# Altium schematic sheet Shift Registers.SchDoc
size A4; SheetNumber: 4; SheetTotal: 4
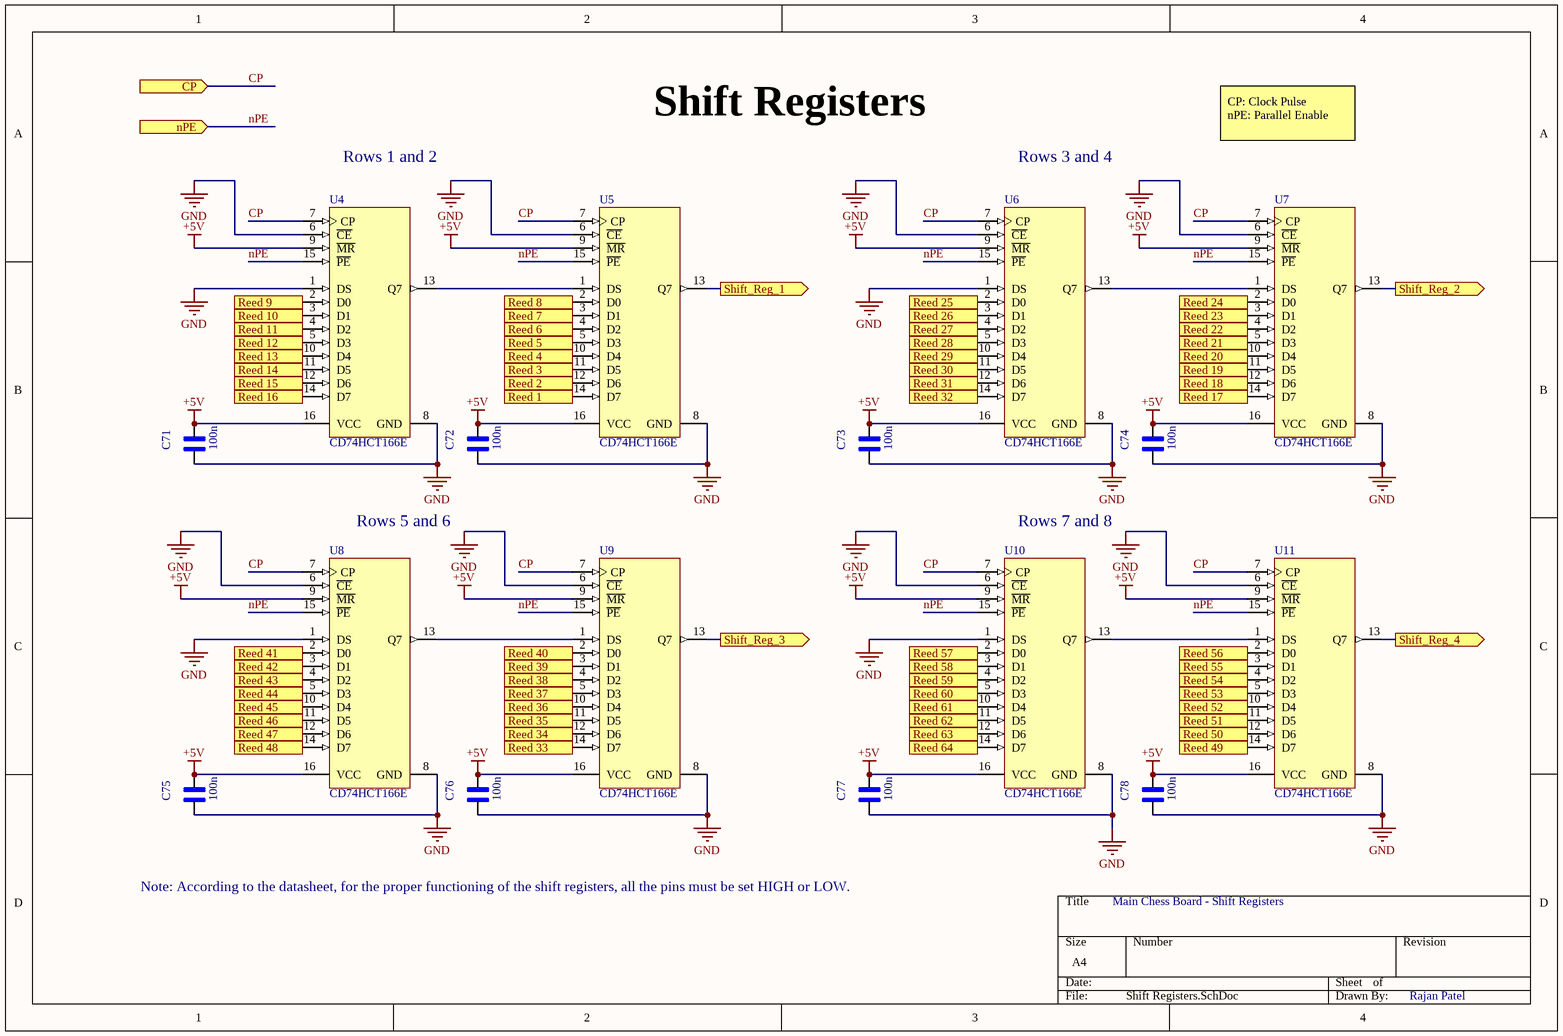
[diagram p0: Shift Registers.SchDoc]

## Parts
C71  100n  [CAP 0805]
C72  100n  [CAP 0805]
C73  100n  [CAP 0805]
C74  100n  [CAP 0805]
C75  100n  [CAP 0805]
C76  100n  [CAP 0805]
C77  100n  [CAP 0805]
C78  100n  [CAP 0805]
U4  CD74HCT166E  [N0016A]
U5  CD74HCT166E  [N0016A]
U6  CD74HCT166E  [N0016A]
U7  CD74HCT166E  [N0016A]
U8  CD74HCT166E  [N0016A]
U9  CD74HCT166E  [N0016A]
U10  CD74HCT166E  [N0016A]
U11  CD74HCT166E  [N0016A]

## Ports
CP (in, see Microcontroller and Power Management[2D]), nPE (in, see Microcontroller and Power Management[2D]), Reed 1 (in, see Reed Switches[1A]), Reed 2 (in, see Reed Switches[2A]), Reed 3 (in, see Reed Switches[3A]), Reed 4 (in, see Reed Switches[4A]), Reed 5 (in, see Reed Switches[5A]), Reed 6 (in, see Reed Switches[6A]), Reed 7 (in, see Reed Switches[6A]), Reed 8 (in, see Reed Switches[7A]), Reed 9 (in, see Reed Switches[1A]), Reed 10 (in, see Reed Switches[2A]), Reed 11 (in, see Reed Switches[3A]), Reed 12 (in, see Reed Switches[4A]), Reed 13 (in, see Reed Switches[5A]), Reed 14 (in, see Reed Switches[6A]), Reed 15 (in, see Reed Switches[6A]), Reed 16 (in, see Reed Switches[7A]), Reed 17 (in, see Reed Switches[1B]), Reed 18 (in, see Reed Switches[2B]), Reed 19 (in, see Reed Switches[3B]), Reed 20 (in, see Reed Switches[4B]), Reed 21 (in, see Reed Switches[5B]), Reed 22 (in, see Reed Switches[6B]), Reed 23 (in, see Reed Switches[6B]), Reed 24 (in, see Reed Switches[7B]), Reed 25 (in, see Reed Switches[1B]), Reed 26 (in, see Reed Switches[2B]), Reed 27 (in, see Reed Switches[3B]), Reed 28 (in, see Reed Switches[4B]), Reed 29 (in, see Reed Switches[5B]), Reed 30 (in, see Reed Switches[6B]), Reed 31 (in, see Reed Switches[6B]), Reed 32 (in, see Reed Switches[7B]), Reed 33 (in, see Reed Switches[1C]), Reed 34 (in, see Reed Switches[2C]), Reed 35 (in, see Reed Switches[3C]), Reed 36 (in, see Reed Switches[4C]), Reed 37 (in, see Reed Switches[5C]), Reed 38 (in, see Reed Switches[6C]), Reed 39 (in, see Reed Switches[6C]), Reed 40 (in, see Reed Switches[7C]), Reed 41 (in, see Reed Switches[1C]), Reed 42 (in, see Reed Switches[2C]), Reed 43 (in, see Reed Switches[3C]), Reed 44 (in, see Reed Switches[4C]), Reed 45 (in, see Reed Switches[5C]), Reed 46 (in, see Reed Switches[6C]), Reed 47 (in, see Reed Switches[6C]), Reed 48 (in, see Reed Switches[7C]), Reed 49 (in, see Reed Switches[1C]), Reed 50 (in, see Reed Switches[2C]), Reed 51 (in, see Reed Switches[3C]), Reed 52 (in, see Reed Switches[4C]), Reed 53 (in, see Reed Switches[5C]), Reed 54 (in, see Reed Switches[6C]), Reed 55 (in, see Reed Switches[6C]), Reed 56 (in, see Reed Switches[7C]), Reed 57 (in, see Reed Switches[1D]), Reed 58 (in, see Reed Switches[2D]), Reed 59 (in, see Reed Switches[3D]), Reed 60 (in, see Reed Switches[4D]), Reed 61 (in, see Reed Switches[5D]), Reed 62 (in, see Reed Switches[6D]), Reed 63 (in, see Reed Switches[6D]), Reed 64 (in, see Reed Switches[7D]), Shift_Reg_1 (out, see Microcontroller and Power Management[2D]), Shift_Reg_2 (out, see Microcontroller and Power Management[2C]), Shift_Reg_3 (out, see Microcontroller and Power Management[2D]), Shift_Reg_4 (out, see Microcontroller and Power Management[2D])

## Nets
+5V: C71.2 C72.2 C73.2 C74.2 C75.2 C76.2 C77.2 C78.2 U4.9(~{MR}) U4.16(VCC) U5.9(~{MR}) U5.16(VCC) U6.9(~{MR}) U6.16(VCC) U7.9(~{MR}) U7.16(VCC) U8.9(~{MR}) U8.16(VCC) U9.9(~{MR}) U9.16(VCC) U10.9(~{MR}) U10.16(VCC) U11.9(~{MR}) U11.16(VCC)
GND: C71.1 C72.1 C73.1 C74.1 C75.1 C76.1 C77.1 C78.1 U4.1(DS) U4.6(~{CE}) U4.8(GND) U5.6(~{CE}) U5.8(GND) U6.1(DS) U6.6(~{CE}) U6.8(GND) U7.6(~{CE}) U7.8(GND) U8.1(DS) U8.6(~{CE}) U8.8(GND) U9.6(~{CE}) U9.8(GND) U10.1(DS) U10.6(~{CE}) U10.8(GND) U11.6(~{CE}) U11.8(GND)
CP: U4.7(CP) U5.7(CP) U6.7(CP) U7.7(CP) U8.7(CP) U9.7(CP) U10.7(CP) U11.7(CP) ; port CP
nPE: U4.15(~{PE}) U5.15(~{PE}) U6.15(~{PE}) U7.15(~{PE}) U8.15(~{PE}) U9.15(~{PE}) U10.15(~{PE}) U11.15(~{PE}) ; port nPE
Reed 1: U5.14(D7) ; port Reed 1
Reed 2: U5.12(D6) ; port Reed 2
Reed 3: U5.11(D5) ; port Reed 3
Reed 4: U5.10(D4) ; port Reed 4
Reed 5: U5.5(D3) ; port Reed 5
Reed 6: U5.4(D2) ; port Reed 6
Reed 7: U5.3(D1) ; port Reed 7
Reed 8: U5.2(D0) ; port Reed 8
Reed 9: U4.2(D0) ; port Reed 9
Reed 10: U4.3(D1) ; port Reed 10
Reed 11: U4.4(D2) ; port Reed 11
Reed 12: U4.5(D3) ; port Reed 12
Reed 13: U4.10(D4) ; port Reed 13
Reed 14: U4.11(D5) ; port Reed 14
Reed 15: U4.12(D6) ; port Reed 15
Reed 16: U4.14(D7) ; port Reed 16
Reed 17: U7.14(D7) ; port Reed 17
Reed 18: U7.12(D6) ; port Reed 18
Reed 19: U7.11(D5) ; port Reed 19
Reed 20: U7.10(D4) ; port Reed 20
Reed 21: U7.5(D3) ; port Reed 21
Reed 22: U7.4(D2) ; port Reed 22
Reed 23: U7.3(D1) ; port Reed 23
Reed 24: U7.2(D0) ; port Reed 24
Reed 25: U6.2(D0) ; port Reed 25
Reed 26: U6.3(D1) ; port Reed 26
Reed 27: U6.4(D2) ; port Reed 27
Reed 28: U6.5(D3) ; port Reed 28
Reed 29: U6.10(D4) ; port Reed 29
Reed 30: U6.11(D5) ; port Reed 30
Reed 31: U6.12(D6) ; port Reed 31
Reed 32: U6.14(D7) ; port Reed 32
Reed 33: U9.14(D7) ; port Reed 33
Reed 34: U9.12(D6) ; port Reed 34
Reed 35: U9.11(D5) ; port Reed 35
Reed 36: U9.10(D4) ; port Reed 36
Reed 37: U9.5(D3) ; port Reed 37
Reed 38: U9.4(D2) ; port Reed 38
Reed 39: U9.3(D1) ; port Reed 39
Reed 40: U9.2(D0) ; port Reed 40
Reed 41: U8.2(D0) ; port Reed 41
Reed 42: U8.3(D1) ; port Reed 42
Reed 43: U8.4(D2) ; port Reed 43
Reed 44: U8.5(D3) ; port Reed 44
Reed 45: U8.10(D4) ; port Reed 45
Reed 46: U8.11(D5) ; port Reed 46
Reed 47: U8.12(D6) ; port Reed 47
Reed 48: U8.14(D7) ; port Reed 48
Reed 49: U11.14(D7) ; port Reed 49
Reed 50: U11.12(D6) ; port Reed 50
Reed 51: U11.11(D5) ; port Reed 51
Reed 52: U11.10(D4) ; port Reed 52
Reed 53: U11.5(D3) ; port Reed 53
Reed 54: U11.4(D2) ; port Reed 54
Reed 55: U11.3(D1) ; port Reed 55
Reed 56: U11.2(D0) ; port Reed 56
Reed 57: U10.2(D0) ; port Reed 57
Reed 58: U10.3(D1) ; port Reed 58
Reed 59: U10.4(D2) ; port Reed 59
Reed 60: U10.5(D3) ; port Reed 60
Reed 61: U10.10(D4) ; port Reed 61
Reed 62: U10.11(D5) ; port Reed 62
Reed 63: U10.12(D6) ; port Reed 63
Reed 64: U10.14(D7) ; port Reed 64
Shift_Reg_1: U5.13(Q7) ; port Shift_Reg_1
Shift_Reg_2: U7.13(Q7) ; port Shift_Reg_2
Shift_Reg_3: U9.13(Q7) ; port Shift_Reg_3
Shift_Reg_4: U11.13(Q7) ; port Shift_Reg_4
NetU4_13: U4.13(Q7) U5.1(DS)
NetU6_13: U6.13(Q7) U7.1(DS)
NetU8_13: U8.13(Q7) U9.1(DS)
NetU10_13: U10.13(Q7) U11.1(DS)

## Notes on the sheet
- Rows 1 and 2
- Shift Registers
- Rows 3 and 4
- CP: Clock Pulse
  nPE: Parallel Enable
- (near U8) Rows 5 and 6
- (near U10) Rows 7 and 8
- Note: According to the datasheet, for the proper functioning of the shift registers, all the pins must be set HIGH or LOW.
- Main Chess Board - Shift Registers
- Rajan Patel

## Library data of the parts
C71-C78 = CAP 0805: SnapEDA_Link: https://www.snapeda.com/parts/C2012X8R1H104K125AA/TDK/view-part/?ref=snap; Check_prices: https://www.snapeda.com/parts/C2012X8R1H104K125AA/TDK/view-part/?ref=eda; Value: *
U4-U11 = CMP-0807-00166-3: High Speed CMOS Logic 8-Bit Parallel-In/Serial-Out Shift Register, N0016A, TUBE; Manufacturer: Texas Instruments; Voltage(Nom)(V): 5; Bits: 8; Output Drive (IOL/IOH)(Max)(mA): 4/-4; F @ Nom Voltage(Max)(Mhz): 25; VCC(Max)(V): 5.5; 3-State Output: No; VCC(Min)(V): 4.5; tpd @ Nom Voltage(Max)(ns): 50; Technology Family: HCT; Input Type: TTL; ICC @ Nom Voltage(Max)(mA): 0.08; Rating: Catalog; Operating Temperature Range(C): -55 to 125; PackageVersion: http://www.ti.com/lit/ml/mpdi002c/mpdi002c.pdf; DatasheetVersion: SCHS157C; Generic Part Number: CD74HCT166; PackageReference: N0016A; Code_JEDEC: MS-001; Output Type: CMOS